# Altium schematic sheet L6203直流电机驱动器.SCHDOC
size A4
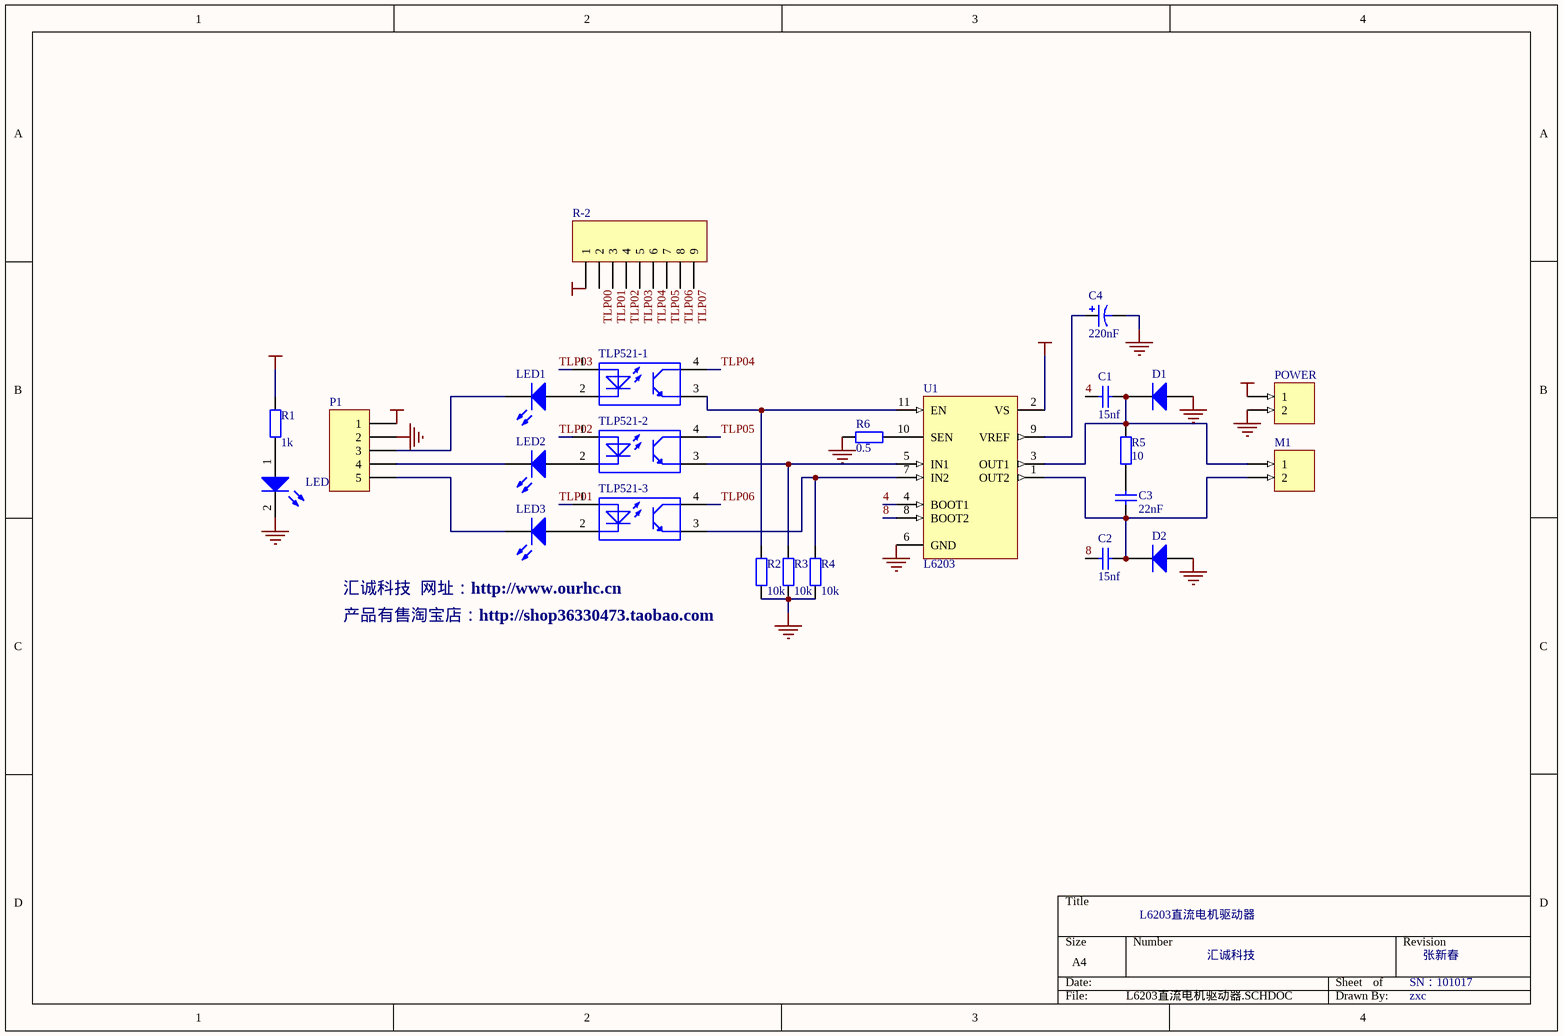
[diagram p0: L6203直流电机驱动器.SCHDOC]

## Parts
C1  value 15nf  [CPDR]
C2  value 15nf  [CPDR]
C3  value 22nF  [CPDR]
C4  value 220nF  [C-DJ-4]
D1  1N4007  [ZCDZL]  (value not drawn)
D2  1N4007  [ZCDZL]  (value not drawn)
LED  LED  [CPDR]  (value not drawn)
LED1  (no value)  [HDR1X2]
LED2  (no value)  [HDR1X2]
LED3  (no value)  [HDR1X2]
M1  (no value)  [JK128_2]
P1  PZ_5  [HDR-5]  (value not drawn)
POWER  (no value)  [JK128_2]
R1  value 1k  [TP-0805-R]  (hidden comment: Res)
R2  value 10k  [TP-0805-R]  (hidden comment: Res)
R3  value 10k  [TP-0805-R]  (hidden comment: Res)
R4  value 10k  [TP-0805-R]  (hidden comment: Res)
R5  value 10  [ZCDZL]  (hidden comment: Res)
R6  value 0.5  [ZCDZL]  (hidden comment: Res)
R-2  (no value)  [HDR1X9]
TLP521-1  (no value)  [DIP-4]
TLP521-2  (no value)  [DIP-4]
TLP521-3  (no value)  [DIP-4]
U1  L6203  [LMD18200]

## Nets
+5V: P1.1 R1.1 R-2.1
GND: C4.2 D1.1(A) D2.1(A) LED.2(K) P1.2 POWER.2 R2.2 R3.2 R4.2 R6.1 U1.6(GND)
Vss: POWER.1 U1.2(VS)
4: C1.2 U1.4(BOOT1)
8: C2.2 U1.8(BOOT2)
TLP00: R-2.2
TLP01: R-2.3 TLP521-3.1
TLP02: R-2.4 TLP521-2.1
TLP03: R-2.5 TLP521-1.1
TLP04: R-2.6 TLP521-1.4
TLP05: R-2.7 TLP521-2.4
TLP06: R-2.8 TLP521-3.4
TLP07: R-2.9
NetC1_1: C1.1 D1.2(K) M1.1 R5.1 U1.3(OUT1)
NetC2_1: C2.1 C3.2 D2.2(K) M1.2 U1.1(OUT2)
NetC3_1: C3.1 R5.2
NetC4_1: C4.1 U1.9(VREF)
NetLED1_1: LED1.1(A) TLP521-1.2
NetLED1_2: LED1.2(K) P1.3
NetLED2_1: LED2.1(A) TLP521-2.2
NetLED2_2: LED2.2(K) P1.4
NetLED3_1: LED3.1(A) TLP521-3.2
NetLED3_2: LED3.2(K) P1.5
NetLED_1: LED.1(A) R1.2
NetR2_1: R2.1 TLP521-1.3 U1.11(EN)
NetR3_1: R3.1 TLP521-2.3 U1.5(IN1)
NetR4_1: R4.1 TLP521-3.3 U1.7(IN2)
NetR6_2: R6.2 U1.10(SEN)

## Notes on the sheet
- 汇诚科技  网址：http://www.ourhc.cn
- 产品有售淘宝店：http://shop36330473.taobao.com
- L6203直流电机驱动器
- 汇诚科技
- SN：101017
- 张新春
- zxc

## Library data of the parts
C1-C3 = Cap: Capacitor; Published: 8-Jun-2000; LatestRevisionDate: 17-Jul-2002; LatestRevisionNote: Re-released for DXP Platform.; Publisher: Altium Limited
C4 = Cap Pol3: Polarized Capacitor (Surface Mount); Published: 8-Jun-2000; LatestRevisionDate: 17-Jul-2002; LatestRevisionNote: Re-released for DXP Platform.; PackageReference: C0805; Publisher: Altium Limited
D1 D2 = Diode 1N4007: 1 Amp General Purpose Rectifier; Published: 8-Jun-2000; LatestRevisionDate: 17-Jul-2002; LatestRevisionNote: Re-released for DXP Platform.; DatasheetDocument: 1998; PackageDocument: Aug-1999; PackageReference: DO-41; Publisher: Altium Limited; Code_JEDEC: DO-204-AL
LED = LED: 发光二极管; Published: 8-Jun-2000; LatestRevisionDate: 17-Jul-2002; LatestRevisionNote: Re-released for DXP Platform.; Publisher: Altium Limited
LED1-LED3 = LED3: Typical BLUE SiC LED; Published: 8-Jun-2000; LatestRevisionDate: 17-Dec-2003; LatestRevisionNote: PCB Footprint replaced.; Publisher: Altium Limited
M1 POWER = MHDR1X2: Header, 2-Pin; LatestRevisionDate: 17-Jul-2002; LatestRevisionNote: Re-released for DXP Platform.; Publisher: Altium Limited
P1 = PZ_5: 排针——5; LatestRevisionDate: 17-Jul-2002; LatestRevisionNote: Re-released for DXP Platform.; Publisher: Altium Limited
R1-R6 = Res: 电阻; Published: 8-Jun-2000; LatestRevisionDate: 17-Jul-2002; LatestRevisionNote: Re-released for DXP Platform.; Publisher: Altium Limited
R-2 = Header 9: Header, 9-Pin; Revision: 17-Jul-2002: Re-released for DXP Platform.; Publisher: Altium Limited
TLP521-1-TLP521-3 = TLP521-1
U1 = L6203: DMOS Full Bridge Driver; Note: TAB connected to pin 6; Published: 8-Jun-2000; LatestRevisionDate: 17-Jul-2002; LatestRevisionNote: Re-released for DXP Platform.; DatasheetDocument: Jul-1997; PackageReference: Multiwatt11; Publisher: Altium Limited; ComponentLink1Description: Manufacturer Link; ComponentLink1URL: http://www.st.com/